# EAGLE design BC7 (EAGLE 7.0.0)
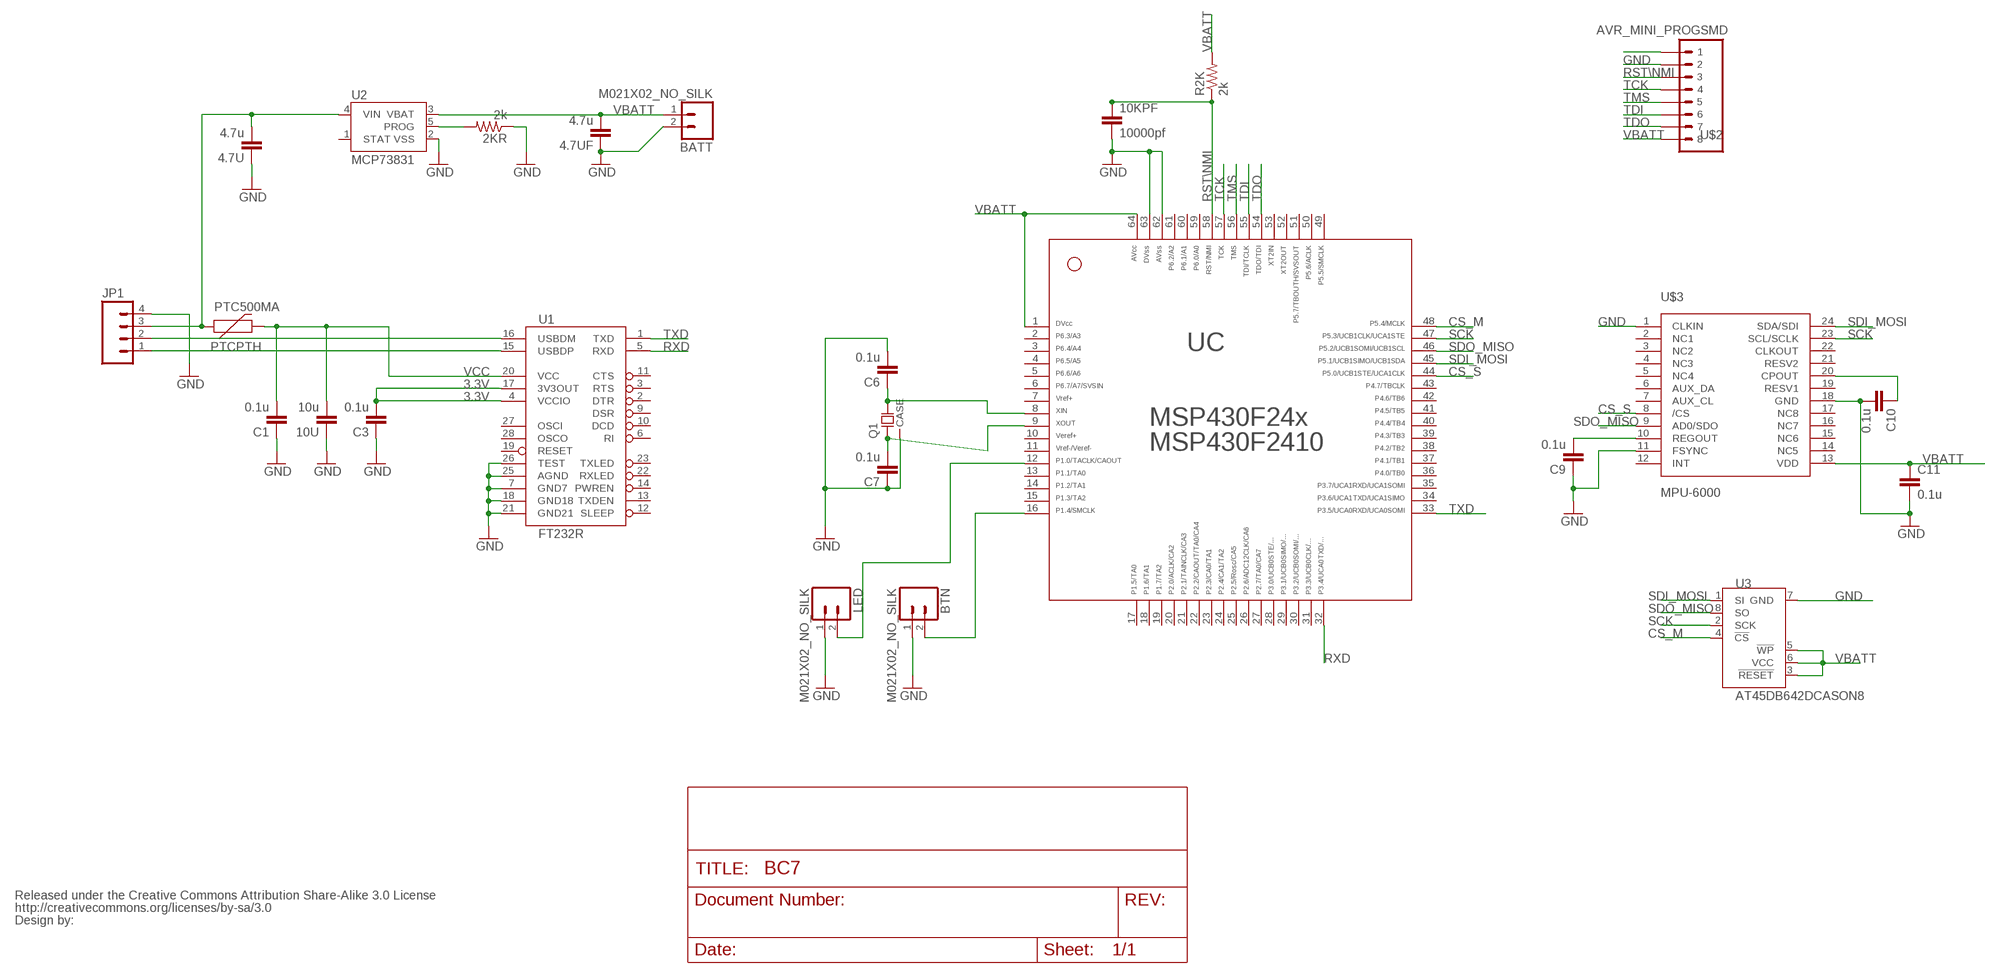
[diagram p0: schematic, sheet 1]

## Parts
2KR  2k  RESISTOR0402-RES  [0402-RES]
4.7U  4.7u  CAP0402-CAP  [0402-CAP]
4.7UF  4.7u  CAP0402-CAP  [0402-CAP]
10KPF  10000pf  CAPEZ  [CAP-PTH-SMALLEZ]
10U  10u  CAP0402-CAP  [0402-CAP]
BATT  M021X02_NO_SILK  [1X02_NO_SILK]
BTN  M021X02_NO_SILK  [1X02_NO_SILK]
C1  0.1u  CAP0402-CAP  [0402-CAP]
C3  0.1u  CAP0402-CAP  [0402-CAP]
C6  0.1u  CAP0402-CAP  [0402-CAP]
C7  0.1u  CAP0402-CAP  [0402-CAP]
C9  0.1u  CAP0402-CAP  [0402-CAP]
C10  0.1u  CAP0402-CAP  [0402-CAP]
C11  0.1u  CAP0402-CAP  [0402-CAP]
JP1  M04LOCK  [1X04_LOCK]
LED  M021X02_NO_SILK  [1X02_NO_SILK]
PTC500MA  PTCPTH  [PTC]
Q1  MS1V-T1K-32.768KHZ/12.5PF/20PPM/TA/QC  [MS1V-T1K]
R2K  2k  R-US_0204/5  [0204/5]
U1  FT232R  FT232RLSSOP  [SSOP28DB]
U2  MCP73831  [SOT23-5]
U3  AT45DB642DCASON8  [CASON8]
U$1  CREATIVE_COMMONS  [CREATIVE_COMMONS]
U$2  AVR_MINI_PROGSMD  [AVR_MINI_PROG]
U$3  MPU-6000  [QFN-24]
UC  F24[X/10]---PM64  [PM/PAG64]

## Nets
3.3V [power]: C3.2 U1.4(VCCIO) U1.17(3V3OUT)
5V: 4.7U.2 JP1.3 PTC500MA.P$1 U2.4(VIN)
BTN: BTN.2 UC.16
CS_M: U3.4(!CS) UC.48
CS_S: U$3.8(/CS) UC.44
GND [power]: 2KR.1 4.7U.1 4.7UF.1 10KPF.2 10U.1 BATT.2 BTN.1 C1.1 C3.1 C6.2 C7.1 C9.1 C10.2 C11.2 JP1.4 LED.1 Q1.CASE U1.7(GND7) U1.18(GND18) U1.21(GND21) U1.25(AGND) U1.26(TEST) U2.2(VSS) U3.7(GND) U$2.2 U$3.1(CLKIN) U$3.11(FSYNC) U$3.18(GND) UC.62 UC.63
N$1: U$2.1
N$2: LED.2 UC.12
N$3: 2KR.2 U2.5(PROG)
N$4: C6.1 Q1.2 UC.8
N$5: C7.2 Q1.1 UC.9
N$6: C9.2 U$3.10(REGOUT)
N$7: C10.1 U$3.20(CPOUT)
RST\NMI: 10KPF.1 R2K.1 U$2.3 UC.58
RXD: U1.5(RXD) UC.32
SCK: U3.2(SCK) U$3.23(SCL/SCLK) UC.47
SDI_MOSI: U3.1(SI) U$3.24(SDA/SDI) UC.45
SDO_MISO: U3.8(SO) U$3.9(AD0/SDO) UC.46
TCK: U$2.4 UC.57
TDI: U$2.6 UC.55
TDO: U$2.7 UC.54
TMS: U$2.5 UC.56
TXD: U1.1(TXD) UC.33
USB_D+: JP1.1 U1.15(USBDP)
USB_D-: JP1.2 U1.16(USBDM)
VBATT: 4.7UF.2 BATT.1 C11.1 R2K.2 U2.3(VBAT) U3.3(!RESET) U3.5(!WP) U3.6(VCC) U$2.8 U$3.13(VDD) UC.1 UC.64
VCC [power]: 10U.2 C1.2 PTC500MA.P$2 U1.20(VCC)
Unconnected: U1.2(DTR) U1.3(RTS) U1.6(RI) U1.9(DSR) U1.10(DCD) U1.11(CTS) U1.12(SLEEP) U1.13(TXDEN) U1.14(PWREN) U1.19(RESET) U1.22(RXLED) U1.23(TXLED) U1.27(OSCI) U1.28(OSCO) U2.1(STAT) U$3.2(NC1) U$3.3(NC2) U$3.4(NC3) U$3.5(NC4) U$3.6(AUX_DA) U$3.7(AUX_CL) U$3.12(INT) U$3.14(NC5) U$3.15(NC6) U$3.16(NC7) U$3.17(NC8) U$3.19(RESV1) U$3.21(RESV2) U$3.22(CLKOUT) UC.2 UC.3 UC.4 UC.5 UC.6 UC.7 UC.10 UC.11 UC.13 UC.14 UC.15 UC.17 UC.18 UC.19 UC.20 UC.21 UC.22 UC.23 UC.24 UC.25 UC.26 UC.27 UC.28 UC.29 UC.30 UC.31 UC.34 UC.35 UC.36 UC.37 UC.38 UC.39 UC.40 UC.41 UC.42 UC.43 UC.49 UC.50 UC.51 UC.52 UC.53 UC.59 UC.60 UC.61

## Library data of the parts
2KR = SparkFun-Passives:RESISTOR: Resistor Basic schematic elements and footprints for 0603, 1206, and PTH resistors.
4.7U 4.7UF 10U C1 C3 C6 C7 C9-C11 = SparkFun-Capacitors:CAP: Capacitor Standard 0603 ceramic capacitor, and 0.1" leaded capacitor.
10KPF = SparkFun-Passives:CAP: Capacitor Standard 0603 ceramic capacitor, and 0.1" leaded capacitor.
BATT BTN LED = SparkFun-Connectors:M02: Standard 2-pin 0.1" header. Use with - straight break away headers ( PRT-00116) - right angle break away headers (PRT-00553) - swiss pins (PRT-00743) - machine pins (PRT-00117) - female headers (PRT-00115) Molex polarized connector foot print use with: PRT-08233 with associated crimp pins and housings. 2.54_SCREWTERM for use with PRT-10571. 3.5mm Screw Terminal footprints for PRT-08084 5mm Screw Terminal footprints for use with PRT-08433
JP1 = SparkFun-Connectors:M04: Header 4 Standard 4-pin 0.1" header. Use with straight break away headers (SKU : PRT-00116), right angle break away headers (PRT-00553), swiss pins (PRT-00743), machine pins (PRT-00117), and female headers (PRT-00115). Molex polarized connector foot print use with SKU : PRT-08231 with associated crimp pins and housings. 1MM SMD Version SKU: PRT-10208
PTC500MA = SparkFun-PowerIC:PTC: Resettable Fuse PTC Resettable Fuse. Spark Fun Electronics SKU : COM-08357
Q1 = T1K:MS1V-T1K-*: p r e l i m i n a r y 5 . 0 . 0 MS1V-T1K Crystaly source: www.microcrystal.com
R2K = resistor:R-US_: RESISTOR, American symbol
U1 = SparkFun:FT232RL: USB UART FT232RL 4th Generation USB UART (USB <-> Serial) Controller. Spark Fun Electronics SKU : COM-00650
U2 = SparkFun-PowerIC:MCP73831: Miniature single cell, fully integrated Li-Ion, Li-polymer charge management controller http://ww1.microchip.com/downloads/en/DeviceDoc/21984a.pdf IC-09995; PROD_ID: IC-09995
U3 = SparkFun-DigitalIC:AT45DB642D: at45db642d memory CASON8 http://www.adestotech.com/at45db642d
U$1 = SparkFun:CREATIVE_COMMONS
U$2 = SparkFun-Connectors2:AVR_MINI_PROG: AVR ISP 6-pin inline header
U$3 = 3DRobotics_Master_Library:MPU-6000: Invensense MPU-6000: 3-axis gyro, 3-axis accel & 9-axis MotionFusion The MPU-60X0 Motion Processing Unit (MPU?) is the world?s first motion processing solution with integrated 9-axis sensor fusion for handset and tablet applications, game controllers, motion pointer remote controls, and other consumer devices. The MPU-60X0 has an embedded 3-axis MEMS gyroscope, 3-axis MEMS accelerometer and Digital Motion Processor? (DMP) hardware accelerator engine with an auxiliary I 2 C port that interfaces to third party digital sensors, such as magnetometers. Interfacing with a 3-axis magnetometer delivers a complete 9-axis sensor fusion output to the MPU?s primary I 2 C or SPI port. (SPI is available on MPU-6000 only). This combines acceleration and rotational motion plus heading information into a single data stream for the application; DATASHEET: http://invensense.com/mems/gyro/documents/PS-MPU-6000A-00_v1.0.pdf; LINK: http://invensense.com/mems/gyro/mpu6000.html; MFGPN: MPU-6000
UC = TI_MSP430_v16:F24[X/10]---PM64: ***MSP430F24[x/10]***PM64

## Net classes
0 default: width 0.203 mm
1 power: width 0.254 mm

## Board
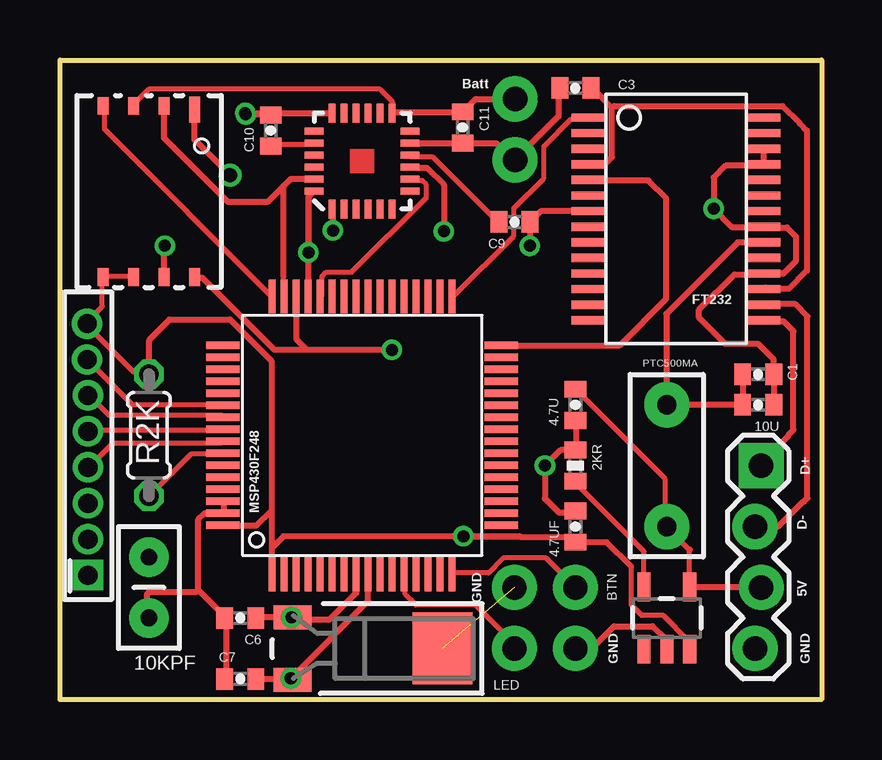
[diagram p1: board, top side]
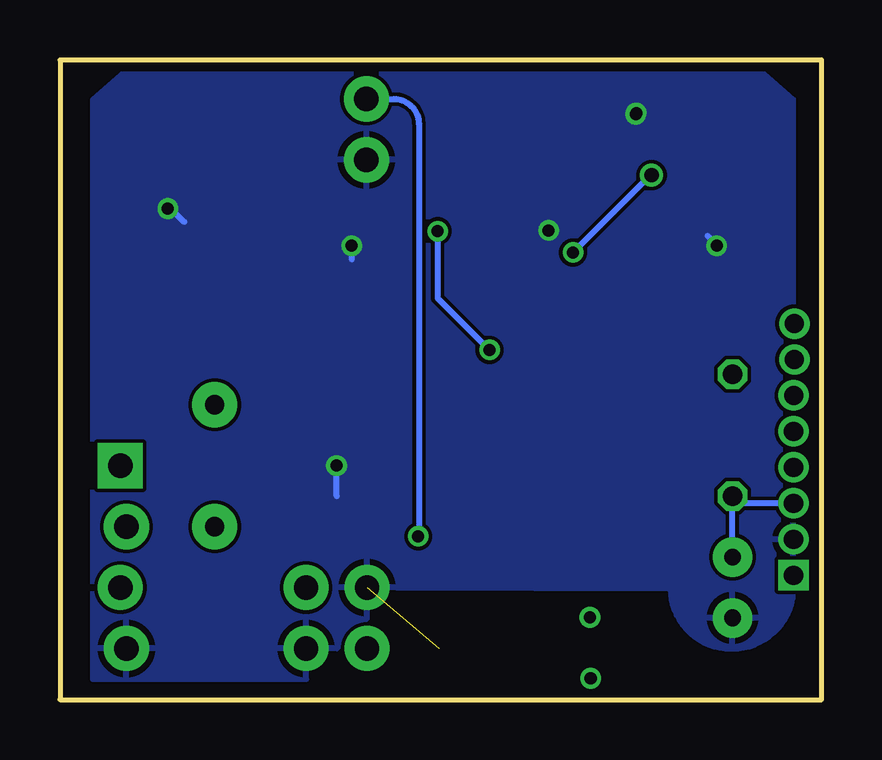
[diagram p2: board, bottom side, seen from below]

Size 31.75 x 26.67 mm. Coordinates in mm from the lower left corner, seen from the top.
Outline: 0,26.67 31.75,26.67 31.75,0 0,0 0,26.67
Copper layers (1*16): Top 0.0356mm / dielectric 1.5011mm / Bottom 0.0356mm
Design rules "LaenPCBOrder": minimum track width 6mil, minimum drill 13mil, track to track 6mil, track to pad 6mil, pad to pad 6mil, via to via 6mil, smd to smd 6mil, copper to edge 15mil, drill to drill 6mil, minimum pad ring 7mil, minimum via ring 7mil, stop-mask expansion 3mil, vias tented up to drill 0mil, thermal gap 10mil

### Footprints (pad centres in the part's own frame; a part is rotated, then mirrored left to right if it is on the bottom)
0402-RES = smd 0.7 x 0.9: 1 -0.65,0; 2 0.65,0
0402-CAP = smd 0.7 x 0.9: 1 -0.65,0; 2 0.65,0
CAP-PTH-SMALLEZ = drill 0.7 pad 1.651: 1 0,0; 2 2.54,0
1X02_NO_SILK = drill 1.016 pad 1.88: 1 0,0; 2 2.54,0
1X04_LOCK = drill 1.016 pad 1.88 square: 1 0,0.127 | drill 1.016 pad 1.88: 2 2.54,-0.127; 3 5.08,0.127; 4 7.62,-0.127
PTC = drill 0.8 pad 1.88: P$1 -2.54,0; P$2 2.54,0
MS1V-T1K = smd 1.6 x 1: 1 2.9,1.3; 2 2.9,-1.3 | smd 2.5 x 3: CASE -3.35,0
0204/5 = drill 0.813 octagon: 1 -2.54,0; 2 2.54,0
SSOP28DB = smd 0.348 x 1.397: 1 -4.225,-3.656; 2 -3.575,-3.656; 3 -2.925,-3.656; 4 -2.275,-3.656; 5 -1.625,-3.656; 6 -0.975,-3.656; 7 -0.325,-3.656; 8 0.325,-3.656; 9 0.975,-3.656; 10 1.625,-3.656; 11 2.275,-3.656; 12 2.925,-3.656; 13 3.575,-3.656; 14 4.225,-3.656; 15 4.225,3.656; 16 3.575,3.656; 17 2.925,3.656; 18 2.275,3.656; 19 1.625,3.656; 20 0.975,3.656; 21 0.325,3.656; 22 -0.325,3.656; 23 -0.975,3.656; 24 -1.625,3.656; 25 -2.275,3.656; 26 -2.925,3.656; 27 -3.575,3.656; 28 -4.225,3.656
SOT23-5 = smd 0.55 x 1.2: 1 -0.95,-1.3; 2 0,-1.3; 3 0.95,-1.3; 4 0.95,1.3; 5 -0.95,1.3
CASON8 = smd 1.067 x 0.451: 1 -3.415,1.905 | smd 0.737 x 0.451: 2 -3.565,0.635; 3 -3.565,-0.635; 4 -3.565,-1.905; 5 3.565,-1.905; 6 3.565,-0.635; 7 3.565,0.635; 8 3.565,1.905
AVR_MINI_PROG = drill 0.8 pad 1.27 square: 1 0,0 | drill 0.8 pad 1.27: 2 1.5,0; 3 3,0; 4 4.5,0; 5 6,0; 6 7.5,0.01; 7 8.999,0.035; 8 10.497,0.035
QFN-24 = smd 0.8 x 0.3: 1 -2,1.25; 2 -2,0.75; 3 -2,0.25; 4 -2,-0.25; 5 -2,-0.75; 6 -2,-1.25; 13 2,-1.25; 14 2,-0.75; 15 2,-0.25; 16 2,0.25; 17 2,0.75; 18 2,1.25 | smd 0.3 x 0.8: 7 -1.25,-2; 8 -0.75,-2; 9 -0.25,-2; 10 0.25,-2; 11 0.75,-2; 12 1.25,-2; 19 1.25,2; 20 0.75,2; 21 0.25,2; 22 -0.25,2; 23 -0.75,2; 24 -1.25,2
PM/PAG64 = smd 1.4 x 0.3: 1 -5.8,3.75; 2 -5.8,3.25; 3 -5.8,2.75; 4 -5.8,2.25; 5 -5.8,1.75; 6 -5.8,1.25; 7 -5.8,0.75; 8 -5.8,0.25; 9 -5.8,-0.25; 10 -5.8,-0.75; 11 -5.8,-1.25; 12 -5.8,-1.75; 13 -5.8,-2.25; 14 -5.8,-2.75; 15 -5.8,-3.25; 16 -5.8,-3.75; 33 5.8,-3.75; 34 5.8,-3.25; 35 5.8,-2.75; 36 5.8,-2.25; 37 5.8,-1.75; 38 5.8,-1.25; 39 5.8,-0.75; 40 5.8,-0.25; 41 5.8,0.25; 42 5.8,0.75; 43 5.8,1.25; 44 5.8,1.75; 45 5.8,2.25; 46 5.8,2.75; 47 5.8,3.25; 48 5.8,3.75 | smd 0.3 x 1.4: 17 -3.75,-5.8; 18 -3.25,-5.8; 19 -2.75,-5.8; 20 -2.25,-5.8; 21 -1.75,-5.8; 22 -1.25,-5.8; 23 -0.75,-5.8; 24 -0.25,-5.8; 25 0.25,-5.8; 26 0.75,-5.8; 27 1.25,-5.8; 28 1.75,-5.8; 29 2.25,-5.8; 30 2.75,-5.8; 31 3.25,-5.8; 32 3.75,-5.8; 49 3.75,5.8; 50 3.25,5.8; 51 2.75,5.8; 52 2.25,5.8; 53 1.75,5.8; 54 1.25,5.8; 55 0.75,5.8; 56 0.25,5.8; 57 -0.25,5.8; 58 -0.75,5.8; 59 -1.25,5.8; 60 -1.75,5.8; 61 -2.25,5.8; 62 -2.75,5.8; 63 -3.25,5.8; 64 -3.75,5.8

### Placement (x,y rotation side)
2KR  21.49,9.75 270 top
4.7U  21.49,12.29 90 top
4.7UF  21.49,7.21 270 top
10KPF  3.71,5.94 270 top
10U  29.11,12.29 180 top
BATT  18.97,25.04 270 top
BTN  21.49,2.13 90 top
C1  29.11,13.56 180 top
C3  21.49,25.5 0 top
C6  7.52,3.4 180 top
C7  7.52,0.86 0 top
C9  18.95,19.91 180 top
C10  8.79,23.72 90 top
C11  16.79,23.85 270 top
JP1  29.11,9.75 270 top
LED  18.95,4.67 270 top
PTC500MA  25.3,9.75 90 top
Q1  12.6,2.13 180 top
R2K  3.71,11.02 90 top
U1  25.68,20.04 270 top
U2  25.3,3.4 0 top
U3  3.71,21.18 270 top
U$1  0,0 0 top
U$2  1.17,5.18 90 top
U$3  12.6,22.45 90 top
UC  12.6,11.02 90 top

### Tracks (layer width: path | path; a pad name or v marks a point on that pad's centre or on a via)
3.3V
  Top 0.254: 23.01,24.66 22.21,25.46 C3.2 | 23.01,24.66 23.01,22.62 22.75,22.35 22.04,22.35 U1.4 | 29.41,17.2 U1.17 30.38,17.12 31.14,17.88 31.14,23.72 30.84,24.03 30.84,24.04 30.12,24.75 23.1,24.75 23.01,24.66
5V
  Top 0.203: 4.7U.2 21.5,12.93 25.23,9.2 25.23,7.24 PTC500MA.P$1 25.32,7.15 26.21,6.26 | 26.21,6.26 26.21,4.75 U2.4 | 26.3,6.26 26.21,6.26
  Top 0.254: JP1.3 26.28,4.67 U2.4
BTN
  Top 0.203: BTN.2 20.26,5.91 18.48,5.91 17.86,5.28 16.43,5.28 UC.16
CS_M
  Top 0.203: U3.4 1.85,24.66 1.85,23.77 8.79,16.84 UC.48
CS_S
  Top 0.203: U$3.8 14.66,21.64 15.1,21.64 15.28,21.46 15.28,20.93 12.17,17.82 11.1,17.82 10.92,17.64 10.92,16.84 UC.44
GND  (via drill 0.5 pad 0.25)  (1 unrouted)
  Top 0.254: 21.5,2.17 BTN.1 | U2.2 25.23,2.17 25.23,2.53 24.7,3.06 23.1,3.06 22.17,2.13 BTN.1 | 19.01,4.66 LED.1 | 21.41,2.26 BTN.1 | UC.62 6.83,8.22 6.83,7.86 UC.63 6.74,7.77 6.03,7.77 5.77,7.51 5.77,4.57 | C7.1 6.92,0.93 6.92,3.33 C6.2 6.83,3.5 5.77,4.57 | 10KPF.2 3.63,3.42 3.63,4.39 3.72,4.48 5.68,4.48 5.77,4.57 | C3.1 20.79,25.46 20.79,24.32 BATT.2 18.95,22.48 18.95,22.45 18.2,23.2 C11.2 U$3.11 14.57,23.24 | U$3.1 11.37,20.48 11.37,19.57 v11.38,19.56 | 11.37,24.4 U$3.18 | C10.2 8.79,24.4 7.76,24.4 v7.75,24.41 | 11.28,24.4 U$3.18 | U1.26 29.32,22.89 29.32,22.35 U1.25 29.41,22.26 27.75,22.26 27.25,21.77 v27.25,20.47 28.02,19.71 U1.21 29.41,19.68 30.3,19.68 30.68,19.3 30.68,18.29 30.15,17.75 29.35,17.75 U1.18 | 29.41,17.82 U1.18 | 21.41,11.68 4.7U.1 21.5,11.6 21.5,10.44 2KR.1 20.87,10.4 v20.22,9.75 20.22,8.38 20.8,7.8 21.42,7.8 4.7UF.1 | U3.7 4.34,18.9 v4.37,18.92 | U1.7 20.05,20.37 C9.1 19.6,18.94 v19.58,18.92 | v7.72,24.46 U$3.18 | 29.32,17.75 U1.18 | U1.18 29.3,17.73 28.12,17.73 26.64,16.26 26.64,15.93 27.74,14.83 29.11,14.83 29.76,14.18 C1.1 10U.1
  Bottom 0.254: v4.37,18.92 4.37,18.95 4.75,19.33 | v11.38,19.56 11.53,19.56 | v7.75,24.41 7.75,24.43 v7.72,24.46 | v19.58,18.92 19.58,18.36 | v27.25,20.47 27.13,20.47 26.57,19.91 | 20.22,8.48 v20.22,9.75
  pour Bottom: 1.17,24.99 2.57,26.21 29.06,26.16 30.38,24.99 30.38,0.86 21.49,0.86 17.68,4.67 6.3,4.65 arc-90 3.78,2.13 3.71,2.13 arc-90 1.17,4.67
N$2
  Top 0.203: UC.12 14.39,5.19 14.39,4.39 14.83,3.95 17.32,3.95 18.92,2.35 18.92,2.17 LED.2
N$3
  Top 0.203: 2KR.2 21.5,9.02 24.35,6.17 24.35,4.75 U2.5
N$4
  Top 0.254: UC.8 12.35,4.45 11.23,3.33 9.8,3.33 Q1.2 8.2,3.43 C6.1
N$5
  Top 0.254: C7.2 9.67,0.86 Q1.1 9.7,0.96 12.85,4.12 UC.9
N$6
  Top 0.203: U$3.10 14.66,22.62 15.54,22.62 18.21,19.95 C9.2
N$7
  Top 0.203: U$3.20 10.57,23.15 8.79,23.15 C10.1
N$13  (via drill 0.51)
  other vias: 9.65,3.43
N$14  (via drill 0.51)
  other vias: 9.63,0.89
RST\NMI
  Top 0.203: UC.58 6.74,10.26 5.5,10.26 3.72,8.48 R2K.1
  Bottom 0.254: 10KPF.1 R2K.1 3.41,8.18 U$2.3
RXD
  Top 0.254: UC.32 23.33,14.77 25.27,16.71 25.27,20.9 24.54,21.64 22.05,21.64 U1.5
SCK
  Top 0.203: 9.32,17.64 9.32,16.84 UC.47
  Top 0.254: 9.32,17.64 9.32,21.41 | 9.32,21.41 9.63,21.72 10.59,21.72 U$3.23 | U3.2 4.34,23.42 7.01,20.75 8.66,20.75 9.32,21.41
SDI_MOSI  (via drill 0.5 pad 0.25, 0.6)
  Top 0.254: U$3.24 10.35,20.95 | 10.35,20.95 UC.45 | 10.35,20.95 10.36,20.94 v10.36,18.64 | U3.1 5.61,23.34 v7.09,21.87
  Bottom 0.254: v7.09,21.87 7.14,21.87 v10.36,18.64
SDO_MISO  (via drill 0.5 pad 0.25)
  Top 0.254: U$3.9 14.63,22.17 15.29,22.17 16,21.46 v16,19.53 | v13.84,14.58 10.31,14.58 | 10.31,14.58 8.94,14.58 5.94,17.58 5.66,17.58 U3.8 | UC.46 9.85,15.04 10.31,14.58
  Bottom 0.254: v16,19.53 16,16.74 v13.84,14.58
TCK
  Top 0.203: UC.57 6.74,10.71 2.21,10.71 1.23,9.73 U$2.4
TDI
  Top 0.203: UC.55 6.74,11.86 2.03,11.86 1.23,12.66 U$2.6
TDO
  Top 0.203: UC.54 6.74,12.31 3.01,12.31 1.14,14.17 U$2.7
TMS
  Top 0.203: UC.56 6.74,11.24 1.23,11.24 U$2.5
TXD
  Top 0.203: U1.1 21.95,24.22 21.32,24.22 20.17,23.06 20.17,21.73 18.92,20.48 18.92,19.33 16.43,16.84 UC.33
USB_D+
  Top 0.254: JP1.1 29.23,9.88 30.38,11.02 30.38,11.05 30.58,11.25 30.58,15.37 30.18,15.77 29.38,15.77 U1.15
USB_D-
  Top 0.254: JP1.2 29.95,7.21 30.99,8.26 31.01,8.26 31.17,8.41 31.17,15.98 30.66,16.48 29.35,16.48 U1.16
VBATT  (via drill 0.5 pad 0.25)
  Top 0.203: 13.86,24.49 U$3.13 13.86,24.57 13.86,24.93 13.32,25.46 3.72,25.46 3.1,24.84 U3.3 3.01,24.75 | 23.81,5.55 23.81,3.95 24.26,3.5 25.15,3.5 26.21,2.44 26.21,2.17 U2.3 | U3.5 1.85,17.64 3.01,17.64 U3.6 | 1.85,17.73 U3.5 | 6.83,7.24 UC.64 | 8.79,5.28 UC.1 | 3.72,13.64 R2K.2 3.63,13.64 3.1,13.64 1.14,15.6 U$2.8 1.14,15.77 1.76,16.4 1.76,17.55 U3.5
  Top 0.254: 16.74,24.45 C11.1 | 3.72,13.64 3.72,15 4.57,15.85 7.09,15.85 8.81,14.12 8.81,7.87 | 8.81,7.87 8.81,5.84 8.84,5.82 | 8.84,5.82 8.84,5.23 UC.1 | UC.64 8.2,7.26 8.81,7.87 | 8.84,5.82 8.84,6.33 9.32,6.81 v16.82,6.81 | 19.19,6.79 19.18,6.81 v16.82,6.81 | 19.19,6.79 16.83,6.79 v16.82,6.81 | C11.1 17.33,25.04 BATT.1 | 13.86,24.49 13.87,24.5 C11.1 | 19.19,6.79 21.26,6.79 arc-90 4.7UF.2 22.8,6.56 23.81,5.55
  Bottom 0.254: v16.82,6.81 16.79,6.83 16.79,24 arc-90 17.83,25.04 BATT.1
VCC
  Top 0.254: U1.20 28.26,19.07 25.27,16.08 25.27,12.32 PTC500MA.P$2 10U.2 C1.2

### Text on the board
tNames: Batt | FT232 | D+ | MSP430F248 | D- | GND | 5V | GND | GND